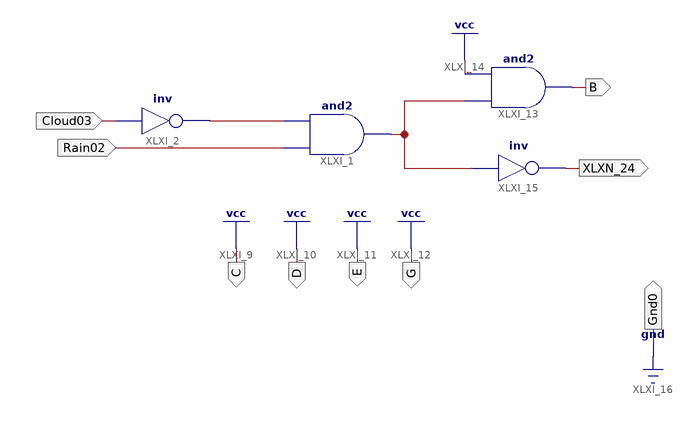
[diagram p0: schematic sheet 1]
// Xilinx ISE schematic e5.sch (spartan6) as structural Verilog: 4 symbols, 9 ports
module e5 (
  input  Rain02,
  input  Cloud03,
  output C,
  output D,
  output E,
  output G,
  output B,
  output XLXN_24,
  output Gnd0
);

  wire MN, XLXN_1;

  and XLXI_1 (MN, Rain02, XLXN_1);
  not XLXI_2 (XLXN_1, Cloud03);
  and XLXI_13 (B, MN, 1'b1);
  not XLXI_15 (XLXN_24, MN);

  assign C = 1'b1;
  assign D = 1'b1;
  assign E = 1'b1;
  assign G = 1'b1;
  assign Gnd0 = 1'b0;
endmodule
